# EAGLE design ESP-WROOM-32-Breakout (EAGLE 9.6.2)
REV: 1
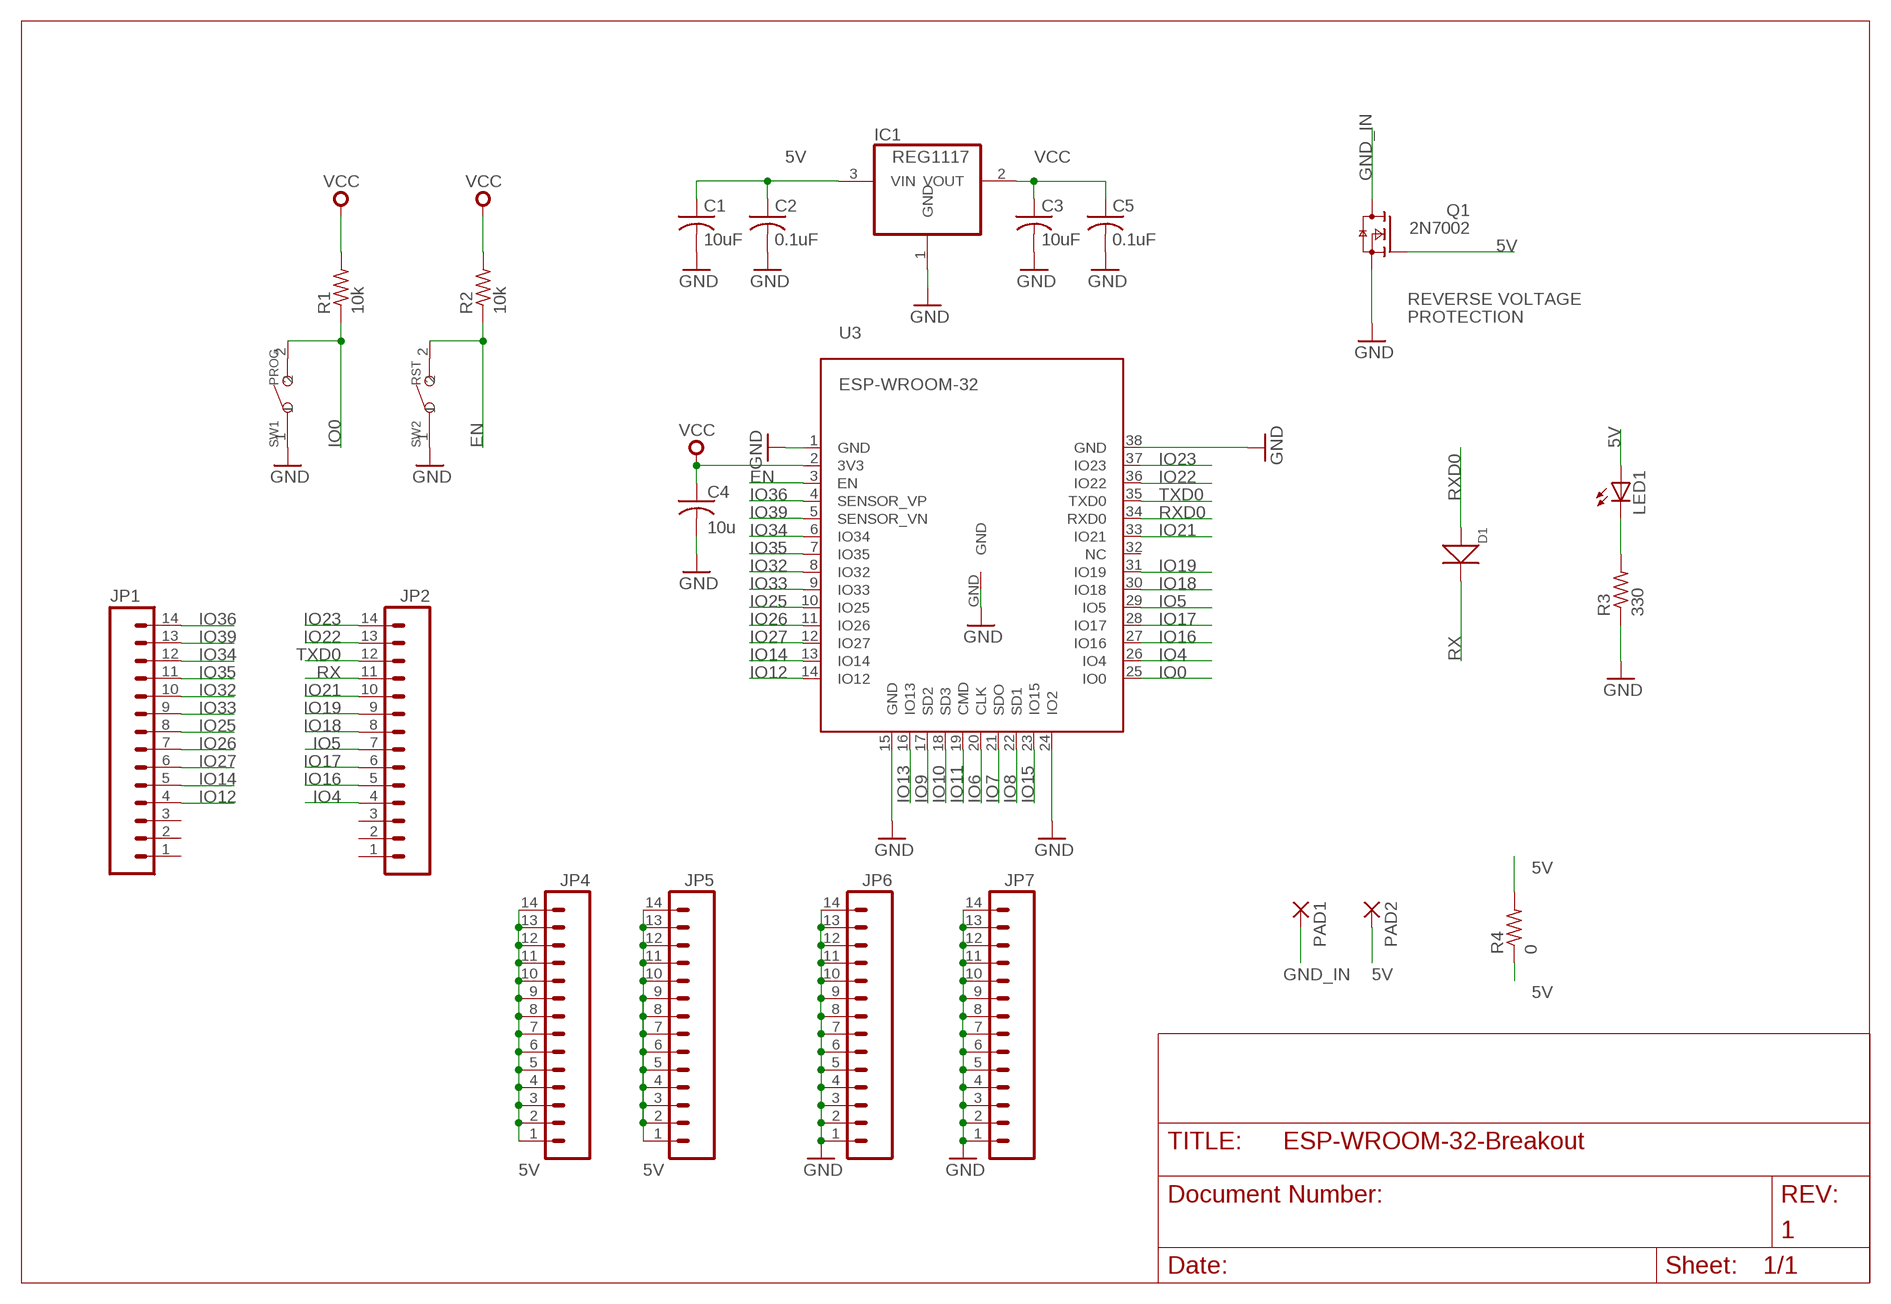
[diagram p0: schematic, sheet 1]

## Parts
C1  10uF  C-USC1206  [C1206]
C2  0.1uF  C-USC1206  [C1206]
C3  10uF  C-USC1206  [C1206]
C4  10u  C-USC1206  [C1206]
C5  0.1uF  C-USC1206  [C1206]
D1  DIODE'0805'  [SOD-323]
IC1  REG1117  [SOT223]
JP1  M14  [1X14]
JP2  M14  [1X14]
JP4  M14  [1X14]
JP5  M14  [1X14]
JP6  M14  [1X14]
JP7  M14  [1X14]
LED1  LEDCHIPLED_1206  [CHIPLED_1206]
PAD1  SMD5  [SMD2,54-5,08]
PAD2  SMD5  [SMD2,54-5,08]
Q1  2N7002  2N7002E  [SOT23]
R1  10k  R-US_R1206  [R1206]
R2  10k  R-US_R1206  [R1206]
R3  330  R-US_R1206  [R1206]
R4  0  R-US_R1206  [R1206]
SW1  PROG  SMD-BUTTON(2P-6.0X3.0X2.5MM)-DHT-1163S  [SW2-4.0-6.0X3.0X2.5MM]
SW2  RST  SMD-BUTTON(2P-6.0X3.0X2.5MM)-DHT-1163S  [SW2-4.0-6.0X3.0X2.5MM]
U3  ESP-WROOM-32  [ESP-WROOM-32]

## Nets
5V: C1.1 C2.1 IC1.3(VIN) JP4.1 JP4.2 JP4.3 JP4.4 JP4.5 JP4.6 JP4.7 JP4.8 JP4.9 JP4.10 JP4.11 JP4.12 JP4.13 JP4.14 JP5.1 JP5.2 JP5.3 JP5.4 JP5.5 JP5.6 JP5.7 JP5.8 JP5.9 JP5.10 JP5.11 JP5.12 JP5.13 JP5.14 LED1.A PAD2.1(P) Q1.1(G) R4.1 R4.2
EN: R2.1 SW2.2 U3.3(EN)
GND [gnd]: C1.2 C2.2 C3.2 C4.2 C5.2 IC1.1(GND) JP6.1 JP6.2 JP6.3 JP6.4 JP6.5 JP6.6 JP6.7 JP6.8 JP6.9 JP6.10 JP6.11 JP6.12 JP6.13 JP6.14 JP7.1 JP7.2 JP7.3 JP7.4 JP7.5 JP7.6 JP7.7 JP7.8 JP7.9 JP7.10 JP7.11 JP7.12 JP7.13 JP7.14 Q1.2(S) R3.1 SW1.1 SW2.1 U3.1(GND) U3.15(GND) U3.24(IO2) U3.38(GND) U3.GND
GND_IN [gnd]: PAD1.1(P) Q1.3(D)
IO0: R1.1 SW1.2 U3.25(IO0)
IO4: JP2.4 U3.26(IO4)
IO5: JP2.7 U3.29(IO5)
IO6: U3.20(CLK)
IO7: U3.21(SDO)
IO8: U3.22(SD1)
IO9: U3.17(SD2)
IO10: U3.18(SD3)
IO11: U3.19(CMD)
IO12: JP1.4 U3.14(IO12)
IO13: U3.16(IO13)
IO14: JP1.5 U3.13(IO14)
IO15: U3.23(IO15)
IO16: JP2.5 U3.27(IO16)
IO17: JP2.6 U3.28(IO17)
IO18: JP2.8 U3.30(IO18)
IO19: JP2.9 U3.31(IO19)
IO21: JP2.10 U3.33(IO21)
IO22: JP2.13 U3.36(IO22)
IO23: JP2.14 U3.37(IO23)
IO25: JP1.8 U3.10(IO25)
IO26: JP1.7 U3.11(IO26)
IO27: JP1.6 U3.12(IO27)
IO32: JP1.10 U3.8(IO32)
IO33: JP1.9 U3.9(IO33)
IO34: JP1.12 U3.6(IO34)
IO35: JP1.11 U3.7(IO35)
IO36: JP1.14 U3.4(SENSOR_VP)
IO39: JP1.13 U3.5(SENSOR_VN)
N$1: LED1.C R3.2
RX: D1.- JP2.11
RXD0: D1.+ U3.34(RXD0)
TXD0: JP2.12 U3.35(TXD0)
VCC [vcc]: C3.1 C4.1 C5.1 IC1.2(VOUT) R1.2 R2.2 U3.2(3V3)
Unconnected: JP1.1 JP1.2 JP1.3 JP2.1 JP2.2 JP2.3 U3.32(NC)

## Notes on the sheet
- REVERSE VOLTAGE
- PROTECTION

## Library data of the parts
C1-C5 = adafruit:C-US: CAPACITOR, American symbol
D1 = Seeed-OPL-Diode:DIODE*
IC1 = burr-brown:REG1117: 800mA and 1A Low Dropout (LDO) Positive Regulator 1.8V, 2.5V, 2.85V, 3.3V, 5V, and Adj; MPN: REG1117; OC_FARNELL: 1097566; OC_NEWARK: 14P6981
JP1 JP2 JP4-JP7 = SparkFun-Connectors:M14: Header 14 Standard 14-pin 0.1" header. Use with straight break away headers (SKU : PRT-00116), right angle break away headers (PRT-00553), swiss pins (PRT-00743), machine pins (PRT-00117), and female headers (PRT-00115).
LED1 = adafruit:LED: LED OSRAM: - CHIPLED LG R971, LG N971, LY N971, LG Q971, LY Q971, LO R971, LY R971 LH N974, LH R974 LS Q976, LO Q976, LY Q976 LO Q996 - Hyper CHIPLED LW Q18S LB Q993, LB Q99A, LB R99A - SideLED LS A670, LO A670, LY A670, LG A670, LP A670 LB A673, LV A673, LT A673, LW A673 LH A674 LY A675 LS A676, LA A676, LO A676, LY A676, LW A676 LS A679, LY A679, LG A679 - Hyper Micro SIDELED® LS Y876, LA Y876, LO Y876, LY Y876 LT Y87S - SmartLED LW L88C, LW L88S LB L89C, LB L89S, LG L890 LS L89K, LO L89K, LY L89K LS L896, LA L896, LO L896, LY L896 - TOPLED LS T670, LO T670, LY T670, LG T670, LP T670 LSG T670, LSP T670, LSY T670, LOP T670, LYG T670 LG T671, LOG T671, LSG T671 LB T673, LV T673, LT T673, LW T673 LH T674 LS T676, LA T676, LO T676, LY T676, LB T676, LH T676, LSB T676, LW T676 LB T67C, LV T67C, LT T67C, LS T67K, LO T67K, LY T67K, LW E67C LS E67B, LA E67B, LO E67B, LY E67B, LB E67C, LV E67C, LT E67C LW T67C LS T679, LY T679, LG T679 LS T770, LO T770, LY T770, LG T770, LP T770 LB T773, LV T773, LT T773, LW T773 LH T774 LS E675, LA E675, LY E675, LS T675 LS T776, LA T776, LO T776, LY T776, LB T776 LHGB T686 LT T68C, LB T68C - Hyper Mini TOPLED® LB M676 - Mini TOPLED Santana® LG M470 LS M47K, LO M47K, LY M47K Source: http://www.osram.convergy.de/
PAD1 PAD2 = wirepad:SMD5: SMD PAD
Q1 = nxp_60_1_1:2N7002: N-channel TrenchMOS FET N-channel enhancement mode Field-Effect Transistor (FET) in a plastic package using TrenchMOS technology. AAL Eindhoven MK
R1-R4 = adafruit:R-US_: RESISTOR, American symbol
SW1 SW2 = Seeed-OPL-Switch:SMD-BUTTON(2P-6.0X3.0X2.5MM): 311020029
U3 = esp32:ESP-WROOM-32

## Net classes
0 default: width 0.254 mm, drill 0.305 mm, clearance 0.152 mm
1 gnd: width 0.635 mm, drill 0.635 mm, clearance 0.254 mm
2 vcc: width 0.406 mm, drill 0.406 mm, clearance 0.254 mm

## Board
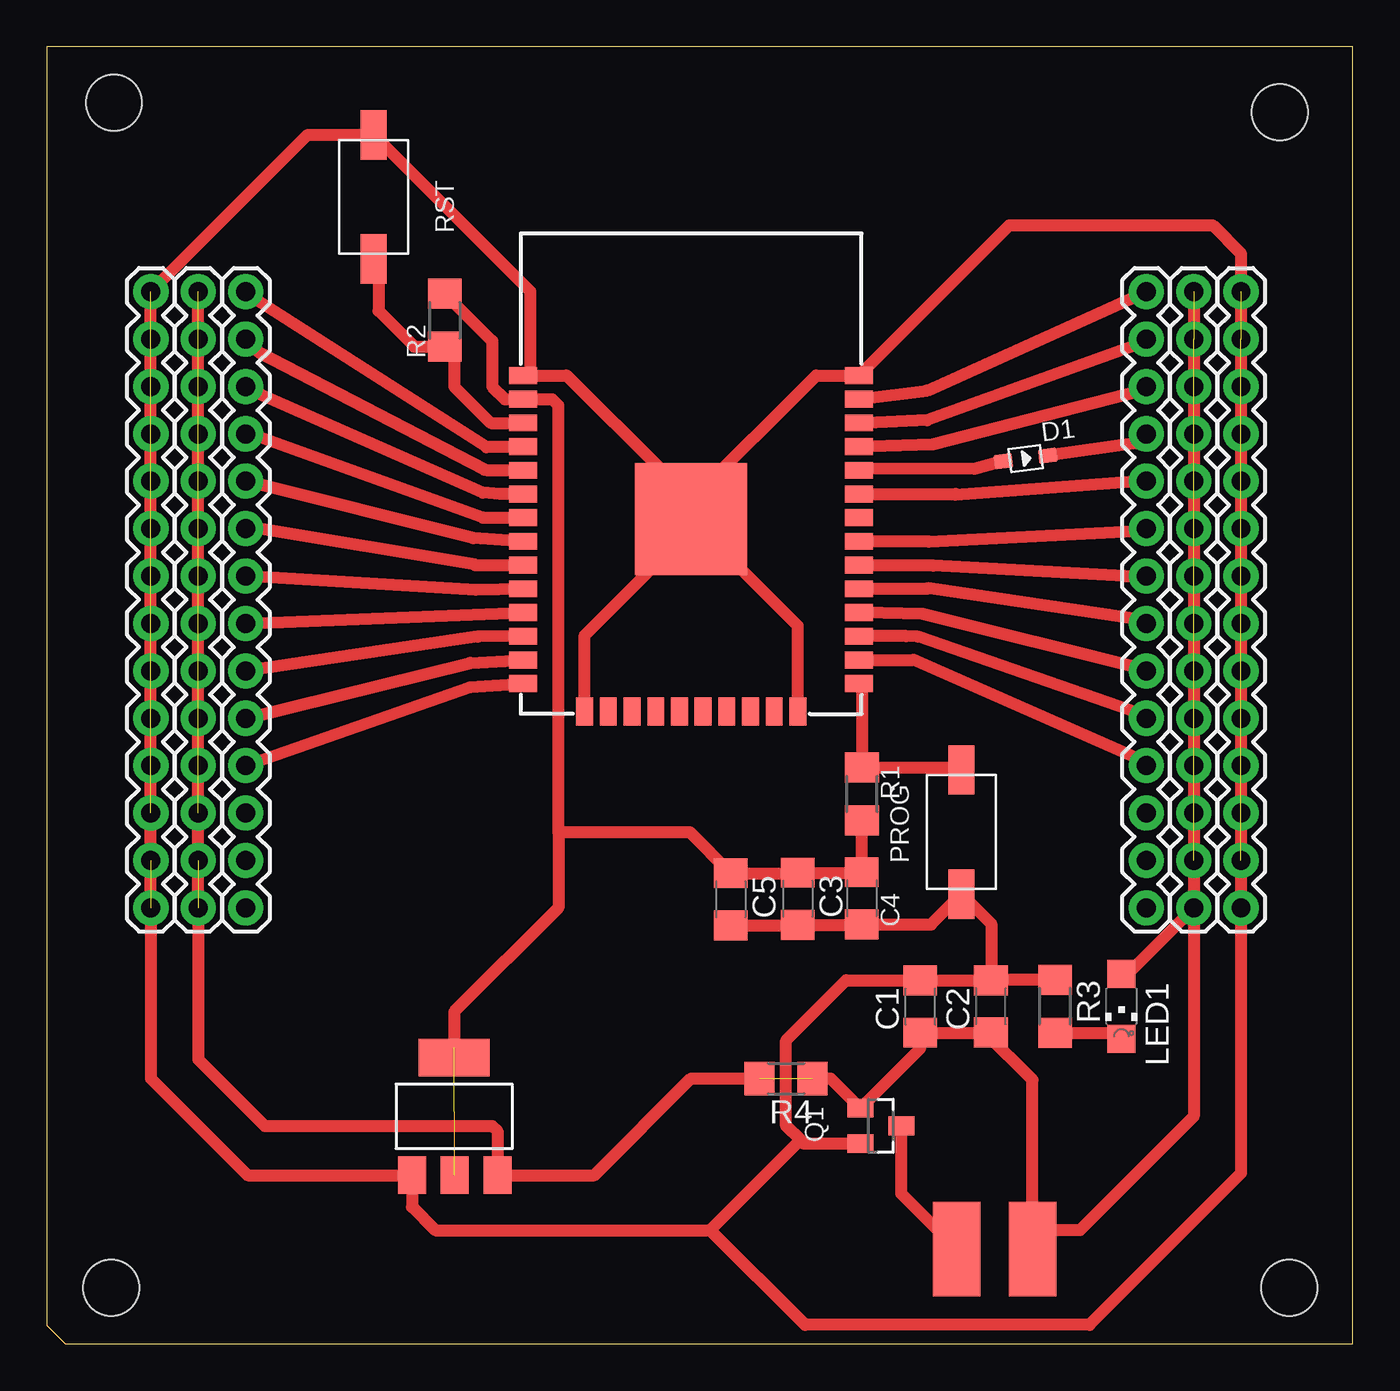
[diagram p1: board, top side]

Size 70 x 69.52 mm. Coordinates in mm from the lower left corner, seen from the top.
Outline: 70,0 70,69.52 0,69.52 0,1 1,0 70,0
Copper layers (1*16): Top 0.035mm / dielectric 1.5mm / Bottom 0.035mm
Design rules "dirt_cheap_dirty_boards.v1": minimum track width 5mil, minimum drill 12mil, track to track 5mil, track to pad 5mil, pad to pad 5mil, via to via 5mil, smd to smd 0mil, copper to edge 10mil, drill to drill 10mil, minimum pad ring 10mil, minimum via ring 6mil, stop-mask expansion 2mil, vias tented up to drill 25mil, thermal gap 10mil
Holes 3 mm at 3.46,3.01 66.6,3.01 66.09,66 3.61,66.51

### Footprints (pad centres in the part's own frame; a part is rotated, then mirrored left to right if it is on the bottom)
C1206 = smd 1.6 x 1.8: 1 -1.4,0; 2 1.4,0
SOD-323 = smd 1 x 0.8: + -1.2,0; - 1.2,0
SOT223 = smd 1.499 x 2.007: 1 -2.261,-3.15; 2 0.025,-3.15; 3 2.311,-3.15 | smd 3.81 x 2.007: 4 0,3.15
1X14 = drill 1.016 pad 1.88: 1 0,0; 2 2.54,0; 3 5.08,0; 4 7.62,0; 5 10.16,0; 6 12.7,0; 7 15.24,0; 8 17.78,0; 9 20.32,0; 10 22.86,0; 11 25.4,0; 12 27.94,0; 13 30.48,0; 14 33.02,0
CHIPLED_1206 = smd 1.5 x 1.5: A 0,-1.75; C 0,1.75
SMD2,54-5,08 = smd 2.54 x 5.08: 1 0,0
SOT23 = smd 1 x 1.4: 1 -0.95,-1.1; 2 0.95,-1.1; 3 0,1.1
R1206 = smd 1.6 x 1.803: 1 -1.422,0; 2 1.422,0
SW2-4.0-6.0X3.0X2.5MM = smd 2.65 x 1.4: 1 -3.325,0; 2 3.325,0
ESP-WROOM-32 = smd 0.9 x 1.5: 1 7.7,9; 2 6.43,9; 3 5.16,9; 4 3.89,9; 5 2.62,9; 6 1.35,9; 7 0.08,9; 8 -1.19,9; 9 -2.46,9; 10 -3.73,9; 11 -5,9; 12 -6.27,9; 13 -7.54,9; 14 -8.81,9; 25 -8.81,-9; 26 -7.54,-9; 27 -6.27,-9; 28 -5,-9; 29 -3.73,-9; 30 -2.46,-9; 31 -1.19,-9; 32 0.08,-9; 33 1.35,-9; 34 2.62,-9; 35 3.89,-9; 36 5.16,-9; 37 6.43,-9; 38 7.7,-9 | smd 1.5 x 0.9: 15 -10.3,5.715; 16 -10.3,4.445; 17 -10.3,3.175; 18 -10.3,1.905; 19 -10.3,0.635; 20 -10.3,-0.635; 21 -10.3,-1.905; 22 -10.3,-3.175; 23 -10.3,-4.445; 24 -10.3,-5.715 | smd 6 x 6: GND 0,0

### Placement (x,y rotation side)
C1  46.82,18.08 90 top
C2  50.6,18.09 90 top
C3  40.25,23.85 270 top
C4  43.69,23.88 270 top
C5  36.66,23.82 270 top
D1  52.46,47.45 7.3 top
IC1  21.84,12.19 0 top
JP1  10.67,23.37 90 top
JP2  58.93,23.37 90 top
JP4  8.13,23.37 90 top
JP5  61.47,23.37 90 top
JP6  5.59,23.37 90 top
JP7  64.01,23.37 90 top
LED1  57.6,18.09 180 top
PAD1  48.77,5.08 0 top
PAD2  52.83,5.08 0 top
Q1  44.7,11.68 270 top
R1  43.69,29.46 270 top
R2  21.34,54.86 90 top
R3  54.04,18.09 270 top
R4  39.62,14.22 180 top
SW1  49.02,27.43 90 top
SW2  17.53,61.47 270 top
U3  34.54,44.2 90 top

### Tracks (layer width: path | path; a pad name or v marks a point on that pad's centre or on a via)
5V  (25 unrouted)
  Top 0.635: JP4.14 JP4.1 8.13,15.24 11.68,11.68 23.88,11.68 24.16,11.4 IC1.3 29.36,9.04 34.54,14.22 R4.2 | JP5.14 JP5.1 | 50.29,16.68 C1.1 46.82,15.85 Q1.1 42.01,14.22 R4.1 | 50.29,16.68 C2.1 | LED1.A 57.94,19.84 JP5.1 | PAD2.1 52.83,6.1 | 52.83,6.1 52.83,14.14 50.29,16.68 | JP5.1 61.47,12.19 55.37,6.1 52.83,6.1
EN
  Top 0.635: U3.3 23.8,49.36 21.84,51.31 21.84,52.93 R2.1 19.71,53.44 17.78,55.37 17.78,57.89 SW2.2
GND  (24 unrouted)
  Top 0.635: U3.1 25.91,51.9 | 25.91,51.9 27.86,51.9 33.02,46.74 33.02,45.72 34.29,44.45 | U3.GND 34.54,45.21 41.23,51.9 U3.38 51.59,59.94 62.48,59.94 64.01,58.42 JP7.14 JP7.1 64.01,9.14 55.88,1.02 40.64,1.02 35.56,6.1 | U3.GND 34.29,44.45 | U3.24 40.26,38.48 U3.GND | 25.91,51.9 25.91,56.41 SW2.1 13.99,64.79 JP6.14 JP6.1 5.59,14.22 10.77,9.04 IC1.1 19.58,7.34 20.83,6.1 35.56,6.1 | U3.15 28.83,37.97 34.29,43.43 34.29,44.45 | 49.02,23.11 SW1.1 | SW1.1 47.39,22.48 C4.2 43.66,22.45 C3.2 40.22,22.42 C5.2 36.97,22.12 | 53.9,19.51 R3.1 50.62,19.51 | 50.62,19.51 C2.2 C1.2 42.85,19.48 39.62,16.26 39.62,11.68 40.39,10.92 | SW1.1 50.62,22.51 50.62,19.51 | Q1.2 40.57,10.73 40.39,10.92 | 35.56,6.1 40.39,10.92
GND_IN
  Top 0.635: PAD1.1 45.8,8.04 Q1.3
IO0
  Top 0.635: U3.25 43.69,35.24 R1.1 48.89,30.89 SW1.2
IO4
  Top 0.254: 46.43,36.68 46.43,36.66
  Top 0.635: U3.26 46.43,36.66 | JP2.4 58.59,31.32 46.43,36.68
IO5
  Top 0.254: JP2.7 58.74,38.8 | 47.2,40.5 47.2,40.47
  Top 0.635: 58.74,38.8 47.2,40.5 | 47.2,40.47 U3.29
IO12
  Top 0.635: JP1.4 22.7,35.2 U3.14
IO14
  Top 0.635: JP1.5 22.7,36.5 U3.13
IO16
  Top 0.254: JP2.5 58.72,33.73
  Top 0.635: 58.72,33.73 46.7,37.9 46.07,37.93 U3.27
IO17
  Top 0.254: U3.28 43.74,39.2 | 58.86,36.13 JP2.6
  Top 0.635: 43.74,39.2 46.94,39.12 58.86,36.13
IO18
  Top 0.254: 47.5,41.7 47.5,41.74
  Top 0.635: U3.30 47.5,41.74 | JP2.8 57.77,41.15 47.5,41.7
IO19
  Top 0.254: JP2.9 58.79,43.55 | 47.26,42.98 47.26,43.01
  Top 0.635: 58.79,43.55 47.26,42.98 | 47.26,43.01 U3.31
IO21
  Top 0.254: 48.7,45.5 48.7,45.55 | 58.75,46.23 JP2.10
  Top 0.635: U3.33 48.7,45.55 | 58.75,46.23 48.7,45.5
IO22
  Top 0.254: JP2.13 58.7,53.62 | 43.94,49.36 U3.36
  Top 0.635: 58.7,53.62 47.2,49.5 43.94,49.36
IO23
  Top 0.635: U3.37 47.2,51.1 JP2.14
IO25
  Top 0.635: U3.10 23,40.4 JP1.8
IO26
  Top 0.635: JP1.7 U3.11
IO27
  Top 0.635: U3.12 23.1,37.9 JP1.6
IO32
  Top 0.635: U3.8 22.86,43.18 JP1.10
IO33
  Top 0.254: 22.96,41.74 22.96,41.76
  Top 0.635: JP1.9 11.37,43.69 22.96,41.76 | 22.96,41.74 U3.9
IO34
  Top 0.254: 10.85,51.13 JP1.12
  Top 0.635: U3.6 24.29,45.55 23.37,45.62 10.85,51.13
IO35
  Top 0.254: JP1.11 10.95,48.77 | 23.37,44.28 23.37,44.3
  Top 0.635: 23.37,44.3 10.95,48.77 | 23.37,44.28 U3.7
IO36
  Top 0.254: JP1.14 10.87,56.19 | 23.57,48.09 23.57,48.06
  Top 0.635: 23.57,48.06 10.87,56.19 | 23.57,48.09 U3.4
IO39
  Top 0.254: 23.61,46.82 23.47,46.84
  Top 0.635: 23.47,46.84 11.39,53.12 JP1.13 | 23.61,46.82 U3.5
N$1
  Top 0.635: R3.2 57.27,16.67 LED1.C
RX
  Top 0.635: JP2.11 58.43,48.27 D1.-
RXD0
  Top 0.254: 43.65,46.92 U3.34
  Top 0.635: D1.+ 49.71,46.89 43.65,46.92
TXD0
  Top 0.254: U3.35 44.14,48.09 | 58.72,51.1 JP2.12
  Top 0.635: 44.14,48.09 47.5,48.2 58.72,51.1
VCC  (1 unrouted)
  Top 0.635: R2.2 23.88,53.75 23.88,51.31 24.56,50.63 U3.2 27.1,50.63 27.43,50.29 27.43,27.43 | R1.2 C4.1 43.66,25.25 C3.1 40.22,25.22 C5.1 | 36.68,25.2 C5.1 | 27.43,27.43 34.45,27.43 C5.1 | 21.84,15.9 21.84,17.78 27.43,23.37 27.43,27.43

### Text on the board
tDocu: 39 | 23 | 36 | 22 | 35 | TX | 34 | RX | 33 | 13 | 32 | 16 | 27 | 11 | 26 | 10 | 25 | 9 | 23 | 8 | 22 | 7 | 21 | 6 | 19 | 5 | 18 | 4 | 5V-in | GND